# EAGLE design v2_routed (EAGLE 5.04)
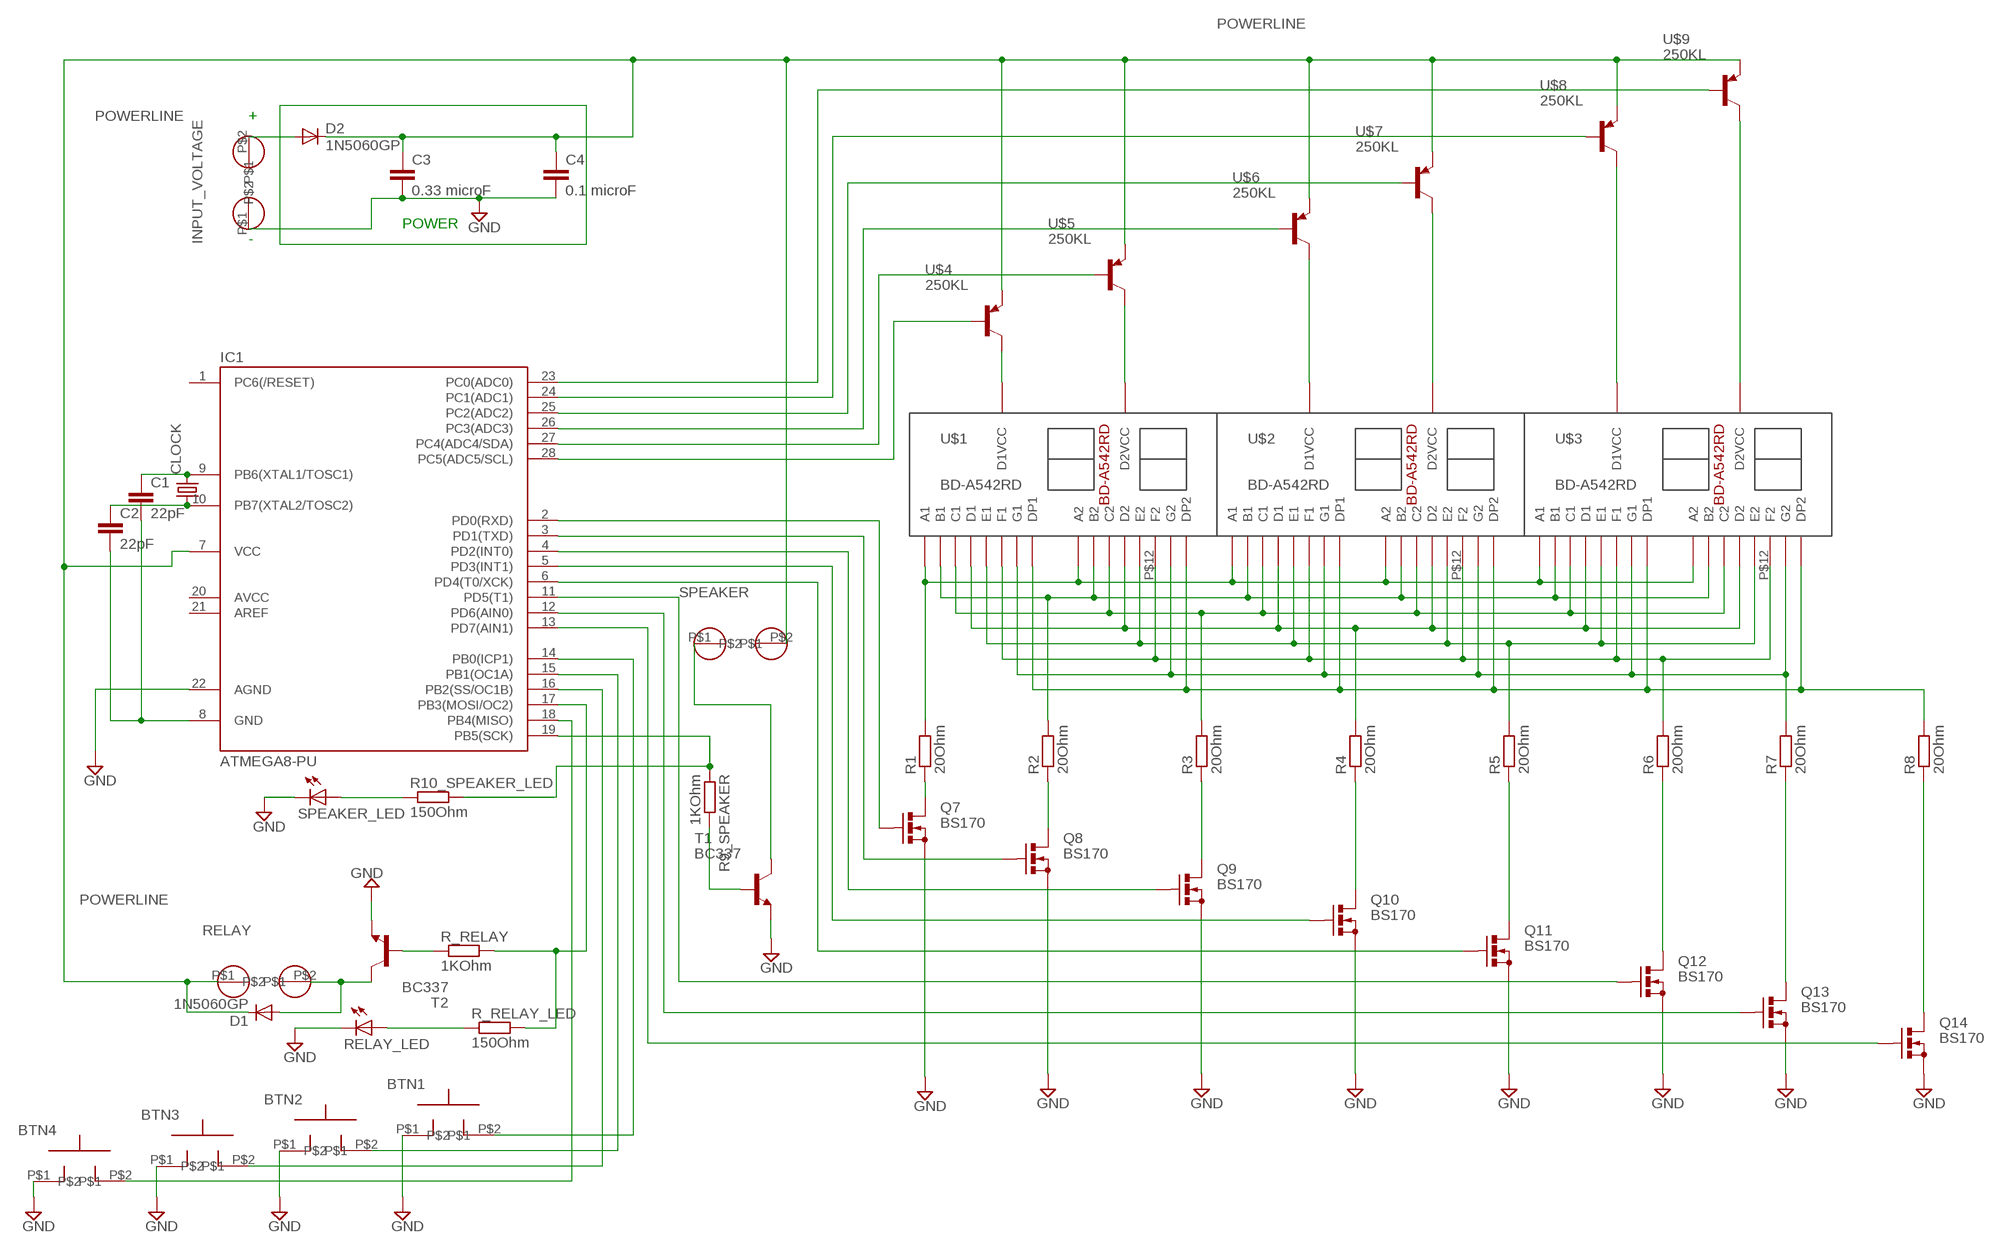
[diagram p0: schematic, sheet 1]

## Parts
BTN1  BUTTON_WIRES  [BUTTON_WIRES]
BTN2  BUTTON_WIRES  [BUTTON_WIRES]
BTN3  BUTTON_WIRES  [BUTTON_WIRES]
BTN4  BUTTON_WIRES  [BUTTON_WIRES]
C1  22pF  C2,5-3  [C2.5-3]
C2  22pF  C2,5-3  [C2.5-3]
C3  0.33 microF  C5/7.2  [C5B7.2]
C4  0.1 microF  C2.5/6  [C2.5-6]
CLOCK  CRYSTALTC26H  [TC26H]
D1  1N5060GP  [DO15-12]
D2  1N5060GP  [DO15-12]
IC1  ATMEGA8-PU  [DIL28-3]
INPUT_VOLTAGE  BUTTON_WIRES  [BUTTON_WIRES]
Q7  BS170  [SOT54E]
Q8  BS170  [SOT54E]
Q9  BS170  [SOT54E]
Q10  BS170  [SOT54E]
Q11  BS170  [SOT54E]
Q12  BS170  [SOT54E]
Q13  BS170  [SOT54E]
Q14  BS170  [SOT54E]
R1  20Ohm  R-EU_0207/15  [0207/15]
R2  20Ohm  R-EU_0207/15  [0207/15]
R3  20Ohm  R-EU_0207/15  [0207/15]
R4  20Ohm  R-EU_0207/15  [0207/15]
R5  20Ohm  R-EU_0207/15  [0207/15]
R6  20Ohm  R-EU_0207/15  [0207/15]
R7  20Ohm  R-EU_0207/15  [0207/15]
R8  20Ohm  R-EU_0207/15  [0207/15]
R9_SPEAKER  1KOhm  R-EU_0207/15  [0207/15]
R10_SPEAKER_LED  150Ohm  R-EU_0207/15  [0207/15]
R_RELAY  1KOhm  R-EU_0207/15  [0207/15]
R_RELAY_LED  150Ohm  R-EU_0207/15  [0207/15]
RELAY  BUTTON_WIRES  [BUTTON_WIRES]
RELAY_LED  LED5MM  [LED5MM]
SPEAKER  BUTTON_WIRES  [BUTTON_WIRES]
SPEAKER_LED  LED5MM  [LED5MM]
T1  BC337  [TO92]
T2  BC337  [TO92]
U$1  BD-A542RD  [BD-A542RD]
U$2  BD-A542RD  [BD-A542RD]
U$3  BD-A542RD  [BD-A542RD]
U$4  250KL  F0806AA  [TO92-EBC]
U$5  250KL  F0806AA  [TO92-EBC]
U$6  250KL  F0806AA  [TO92-EBC]
U$7  250KL  F0806AA  [TO92-EBC]
U$8  250KL  F0806AA  [TO92-EBC]
U$9  250KL  F0806AA  [TO92-EBC]

## Nets
GND: BTN1.P$1 BTN2.P$1 BTN3.P$1 BTN4.P$1 C3.2 C4.2 IC1.22(AGND) INPUT_VOLTAGE.P$1 Q7.S Q8.S Q9.S Q10.S Q11.S Q12.S Q13.S Q14.S RELAY_LED.K(C) SPEAKER_LED.K(C) T1.1(E) T2.1(E)
N$1: R1.2 U$1.P$11(A2) U$1.P$16(A1) U$2.P$11(A2) U$2.P$16(A1) U$3.P$11(A2) U$3.P$16(A1)
N$2: R2.2 U$1.P$10(B2) U$1.P$15(B1) U$2.P$10(B2) U$2.P$15(B1) U$3.P$10(B2) U$3.P$15(B1)
N$3: R3.2 U$1.P$3(C1) U$1.P$8(C2) U$2.P$3(C1) U$2.P$8(C2) U$3.P$3(C1) U$3.P$8(C2)
N$4: R4.2 U$1.P$2(D1) U$1.P$6(D2) U$2.P$2(D1) U$2.P$6(D2) U$3.P$2(D1) U$3.P$6(D2)
N$5: R5.2 U$1.P$1(E1) U$1.P$5(E2) U$2.P$1(E1) U$2.P$5(E2) U$3.P$1(E1) U$3.P$5(E2)
N$6: R6.2 U$1.P$12(F2) U$1.P$18(F1) U$2.P$12(F2) U$2.P$18(F1) U$3.P$12(F2) U$3.P$18(F1)
N$7: R7.2 U$1.P$7(G2) U$1.P$17(G1) U$2.P$7(G2) U$2.P$17(G1) U$3.P$7(G2) U$3.P$17(G1)
N$8: R8.2 U$1.P$4(DP1) U$1.P$9(DP2) U$2.P$4(DP1) U$2.P$9(DP2) U$3.P$4(DP1) U$3.P$9(DP2)
N$9: U$1.P$14(D1VCC) U$4.C
N$10: U$1.P$13(D2VCC) U$5.C
N$11: U$2.P$14(D1VCC) U$6.C
N$12: U$2.P$13(D2VCC) U$7.C
N$13: U$3.P$14(D1VCC) U$8.C
N$14: U$3.P$13(D2VCC) U$9.C
N$15: Q7.D R1.1
N$16: Q8.D R2.1
N$17: Q9.D R3.1
N$18: Q10.D R4.1
N$19: Q11.D R5.1
N$20: Q12.D R6.1
N$21: Q13.D R7.1
N$22: Q14.D R8.1
N$23: IC1.28(PC5(ADC5/SCL)) U$4.B
N$24: IC1.27(PC4(ADC4/SDA)) U$5.B
N$25: IC1.26(PC3(ADC3)) U$6.B
N$26: IC1.25(PC2(ADC2)) U$7.B
N$27: IC1.24(PC1(ADC1)) U$8.B
N$28: IC1.23(PC0(ADC0)) U$9.B
N$29: IC1.2(PD0(RXD)) Q7.G
N$30: IC1.3(PD1(TXD)) Q8.G
N$31: IC1.4(PD2(INT0)) Q9.G
N$32: IC1.5(PD3(INT1)) Q10.G
N$33: IC1.6(PD4(T0/XCK)) Q11.G
N$34: IC1.11(PD5(T1)) Q12.G
N$35: IC1.12(PD6(AIN0)) Q13.G
N$36: IC1.13(PD7(AIN1)) Q14.G
N$37: BTN1.P$2 IC1.14(PB0(ICP1))
N$38: BTN2.P$2 IC1.15(PB1(OC1A))
N$39: BTN3.P$2 IC1.16(PB2(SS/OC1B))
N$40: BTN4.P$2 IC1.18(PB4(MISO))
N$41: C1.1 CLOCK.2 IC1.9(PB6(XTAL1/TOSC1))
N$42: C2.1 CLOCK.1 IC1.10(PB7(XTAL2/TOSC2))
N$43: C1.2 C2.2 IC1.8(GND)
N$44: IC1.19(PB5(SCK)) R9_SPEAKER.1 R10_SPEAKER_LED.2
N$45: R9_SPEAKER.2 T1.2(B)
N$46: SPEAKER.P$1 T1.3(C)
N$47: D2.A INPUT_VOLTAGE.P$2
N$49: R10_SPEAKER_LED.1 SPEAKER_LED.A
N$50: IC1.17(PB3(MOSI/OC2)) R_RELAY.2 R_RELAY_LED.2
N$51: R_RELAY.1 T2.2(B)
N$52: D1.A RELAY.P$2 T2.3(C)
N$54: R_RELAY_LED.1 RELAY_LED.A
POWERLINE: C3.1 C4.1 D1.C D2.C IC1.7(VCC) RELAY.P$1 SPEAKER.P$2 U$4.E U$5.E U$6.E U$7.E U$8.E U$9.E
Unconnected: IC1.1(PC6(/RESET)) IC1.20(AVCC) IC1.21(AREF)

## Notes on the sheet
- +
- POWER
- -

## Library data of the parts
BTN1-BTN4 = button_wires:BUTTON_WIRES
C1-C4 = capacitor-wima:C: CAPACITOR naming: grid - package width
CLOCK = crystal:CRYSTAL: CRYSTAL
D1 D2 = diode:1N5060GP: DIODE controlled avalanche rectifier
IC1 = atmega8:ATMEGA8-PU
INPUT_VOLTAGE RELAY SPEAKER = output_wires:BUTTON_WIRES
Q7-Q14 = transistor-small-signal:BS170: N-CHANNEL MOS FET
R1-R8 R9_SPEAKER R10_SPEAKER_LED R_RELAY R_RELAY_LED = resistor:R-EU_: RESISTOR, European symbol
RELAY_LED SPEAKER_LED = led:LED: LED OSRAM: - CHIPLED LG R971, LG N971, LY N971, LG Q971, LY Q971, LO R971, LY R971 LH N974, LH R974 LS Q976, LO Q976, LY Q976 LO Q996 - Hyper CHIPLED LW Q18S LB Q993, LB Q99A, LB R99A - SideLED LS A670, LO A670, LY A670, LG A670, LP A670 LB A673, LV A673, LT A673, LW A673 LH A674 LY A675 LS A676, LA A676, LO A676, LY A676, LW A676 LS A679, LY A679, LG A679 - Hyper Micro SIDELED® LS Y876, LA Y876, LO Y876, LY Y876 LT Y87S - SmartLED LW L88C, LW L88S LB L89C, LB L89S, LG L890 LS L89K, LO L89K, LY L89K LS L896, LA L896, LO L896, LY L896 - TOPLED LS T670, LO T670, LY T670, LG T670, LP T670 LSG T670, LSP T670, LSY T670, LOP T670, LYG T670 LG T671, LOG T671, LSG T671 LB T673, LV T673, LT T673, LW T673 LH T674 LS T676, LA T676, LO T676, LY T676, LB T676, LH T676, LSB T676, LW T676 LB T67C, LV T67C, LT T67C, LS T67K, LO T67K, LY T67K, LW E67C LS E67B, LA E67B, LO E67B, LY E67B, LB E67C, LV E67C, LT E67C LW T67C LS T679, LY T679, LG T679 LS T770, LO T770, LY T770, LG T770, LP T770 LB T773, LV T773, LT T773, LW T773 LH T774 LS E675, LA E675, LY E675, LS T675 LS T776, LA T776, LO T776, LY T776, LB T776 LHGB T686 LT T68C, LB T68C - Hyper Mini TOPLED® LB M676 - Mini TOPLED Santana® LG M470 LS M47K, LO M47K, LY M47K Source: http://www.osram.convergy.de LUXEON: - LUMILED® LXK2-PW12-R00, LXK2-PW12-S00, LXK2-PW14-U00, LXK2-PW14-V00 LXK2-PM12-R00, LXK2-PM12-S00, LXK2-PM14-U00 LXK2-PE12-Q00, LXK2-PE12-R00, LXK2-PE12-S00, LXK2-PE14-T00, LXK2-PE14-U00 LXK2-PB12-K00, LXK2-PB12-L00, LXK2-PB12-M00, LXK2-PB14-N00, LXK2-PB14-P00, LXK2-PB14-Q00 LXK2-PR12-L00, LXK2-PR12-M00, LXK2-PR14-Q00, LXK2-PR14-R00 LXK2-PD12-Q00, LXK2-PD12-R00, LXK2-PD12-S00 LXK2-PH12-R00, LXK2-PH12-S00 LXK2-PL12-P00, LXK2-PL12-Q00, LXK2-PL12-R00 Source: www.luxeon.com KINGBRIGHT: KA-3528ASYC Source: www.kingbright.com
T1 T2 = transistor:BC337: NPN TRANSISTOR
U$1-U$3 = bd-a542rd:BD-A542RD
U$4-U$9 = transistor-pnp:F0806AA

## Board
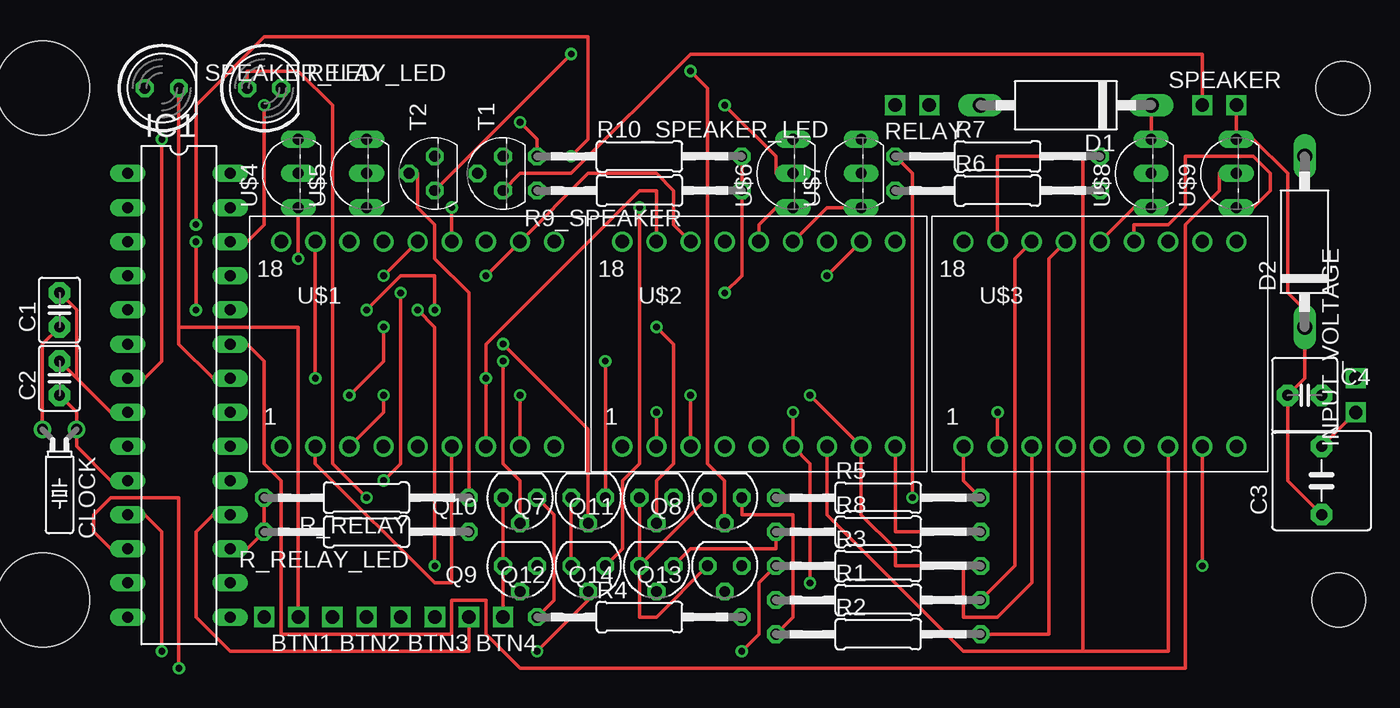
[diagram p1: board, top side]
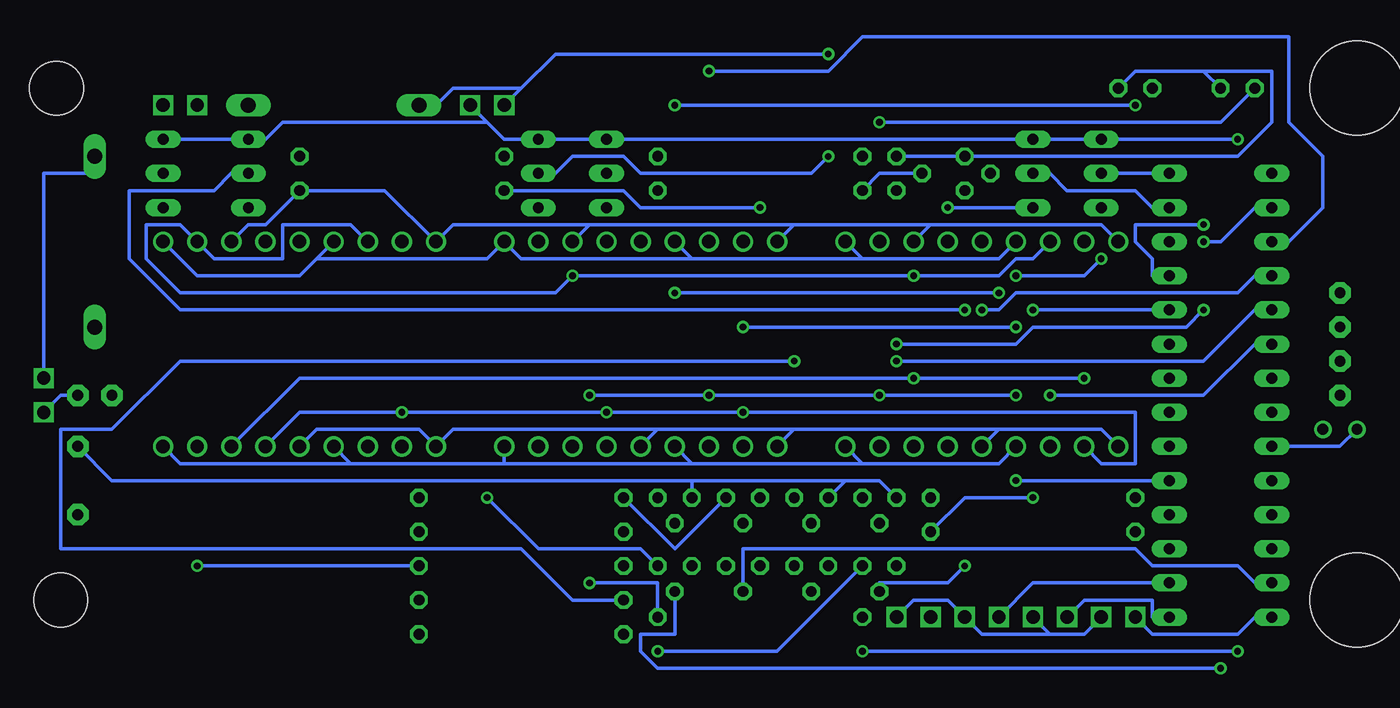
[diagram p2: board, bottom side, seen from below]

No outline drawn. Coordinates in mm, seen from the top.
Copper layers (1*16): Top 0.035mm / dielectric 1.5mm / Bottom 0.035mm
Design rules "agu_default": minimum track width 0.25mm, minimum drill 0.5mm, track to track 0.25mm, track to pad 0.25mm, pad to pad 0.25mm, via to via 0.25mm, smd to smd 0mil, copper to edge 40mil, drill to drill 8mil, minimum pad ring 10mil, minimum via ring 8mil, stop-mask expansion 4mil, vias tented up to drill 0mil, thermal gap 10mil
Holes 7 mm at 5.08,5.08 5.08,43.18
Holes 4 mm at 101.92,43.18 101.6,5.08

### Footprints (pad centres in the part's own frame; a part is rotated, then mirrored left to right if it is on the bottom)
BUTTON_WIRES = drill 1 square: P$1 -1.27,0; P$2 1.27,0
C2.5-3 = drill 0.813 pad 1.6 octagon: 1 -1.27,0; 2 1.27,0
C5B7.2 = drill 0.813 pad 1.6 octagon: 1 -2.54,0; 2 2.54,0
C2.5-6 = drill 0.813 pad 1.6 octagon: 1 -1.27,0; 2 1.27,0
TC26H = drill 0.813 round: 1 -1.27,0; 2 1.27,0
DO15-12 = drill 1.118 long: A 6.35,0; C -6.35,0
DIL28-3 = drill 0.813 long: 1 -16.51,-3.81; 2 -13.97,-3.81; 3 -11.43,-3.81; 4 -8.89,-3.81; 5 -6.35,-3.81; 6 -3.81,-3.81; 7 -1.27,-3.81; 8 1.27,-3.81; 9 3.81,-3.81; 10 6.35,-3.81; 11 8.89,-3.81; 12 11.43,-3.81; 13 13.97,-3.81; 14 16.51,-3.81; 15 16.51,3.81; 16 13.97,3.81; 17 11.43,3.81; 18 8.89,3.81; 19 6.35,3.81; 20 3.81,3.81; 21 1.27,3.81; 22 -1.27,3.81; 23 -3.81,3.81; 24 -6.35,3.81; 25 -8.89,3.81; 26 -11.43,3.81; 27 -13.97,3.81; 28 -16.51,3.81
SOT54E = drill 0.813 octagon: D -1.27,0; G 0,1.905; S 1.27,0
0207/15 = drill 0.813 octagon: 1 -7.62,0; 2 7.62,0
LED5MM = drill 0.813 octagon: A -1.27,0; K 1.27,0
TO92 = drill 0.813 octagon: 1 1.27,0; 2 0,1.905; 3 -1.27,0
BD-A542RD = drill 1 round: P$1 -10.16,-7.62; P$2 -7.62,-7.62; P$3 -5.08,-7.62; P$4 -2.54,-7.62; P$5 0,-7.62; P$6 2.54,-7.62; P$7 5.08,-7.62; P$8 7.62,-7.62; P$9 10.16,-7.62; P$10 10.16,7.62; P$11 7.62,7.62; P$12 5.08,7.62; P$13 2.54,7.62; P$14 0,7.62; P$15 -2.54,7.62; P$16 -5.08,7.62; P$17 -7.62,7.62; P$18 -10.16,7.62
TO92-EBC = drill 0.813 long: B 0,-1.27; C -2.54,-1.27; E 2.54,-1.27

### Placement (x,y rotation side)
BTN1  22.86,3.81 180 top
BTN2  27.94,3.81 180 top
BTN3  33.02,3.81 180 top
BTN4  38.1,3.81 180 top
C1  6.35,26.67 90 top
C2  6.35,21.59 90 top
C3  100.33,13.97 90 top
C4  99.06,20.32 0 top
CLOCK  6.35,17.78 180 top
D1  81.28,41.91 180 top
D2  99.06,31.75 90 top
IC1  15.24,20.32 270 top
INPUT_VOLTAGE  102.87,20.32 90 top
Q7  45.72,12.7 180 top
Q8  55.88,12.7 180 top
Q9  40.64,7.62 180 top
Q10  40.64,12.7 180 top
Q11  50.8,12.7 180 top
Q12  45.72,7.62 180 top
Q13  55.88,7.62 180 top
Q14  50.8,7.62 180 top
R1  67.31,5.08 0 top
R2  67.31,2.54 0 top
R3  67.31,7.62 0 top
R4  49.53,3.81 0 top
R5  67.31,12.7 0 top
R6  76.2,35.56 0 top
R7  76.2,38.1 0 top
R8  67.31,10.16 0 top
R9_SPEAKER  49.53,35.56 180 top
R10_SPEAKER_LED  49.53,38.1 0 top
R_RELAY  29.21,12.7 180 top
R_RELAY_LED  29.21,10.16 180 top
RELAY  69.85,41.91 180 top
RELAY_LED  21.59,43.18 0 top
SPEAKER  92.71,41.91 0 top
SPEAKER_LED  13.97,43.18 0 top
T1  39.37,36.83 90 top
T2  34.29,36.83 90 top
U$1  33.02,24.13 0 top
U$2  58.42,24.13 0 top
U$3  83.82,24.13 0 top
U$4  22.86,36.83 90 top
U$5  27.94,36.83 90 top
U$6  59.69,36.83 90 top
U$7  64.77,36.83 90 top
U$8  86.36,36.83 90 top
U$9  92.71,36.83 90 top

### Tracks (layer width: path | path; a pad name or v marks a point on that pad's centre or on a via)
GND
  Top 0.25: 15.24,25.4 SPEAKER_LED.K | 15.24,25.4 15.24,24.13 17.78,21.59 IC1.22 | Q14.S Q11.S | Q13.S 50.8,3.81 49.53,3.81 Q14.S | Q8.S Q14.S | C3.2 INPUT_VOLTAGE.P$1 | Q7.S Q12.S | BTN4.P$1 Q9.S Q10.S | 15.24,25.4 24.13,25.4 BTN1.P$1
  Bottom 0.25: T1.1 T2.1 13.97,38.1 11.43,40.64 11.43,44.45 16.51,44.45 | SPEAKER_LED.K 16.51,44.45 | 16.51,44.45 21.59,44.45 RELAY_LED.K | BTN1.P$1 25.4,2.54 27.94,2.54 | 27.94,2.54 BTN2.P$1 | 27.94,2.54 33.02,2.54 BTN3.P$1 35.56,5.08 38.1,5.08 BTN4.P$1 | INPUT_VOLTAGE.P$1 101.6,20.32 C4.2 | 43.18,13.97 Q7.S | 43.18,13.97 40.64,13.97 Q10.S | C3.2 97.79,13.97 54.61,13.97 | 43.18,13.97 54.61,13.97 | 54.61,13.97 Q8.S
N$1  (via drill 0.5)
  Top 0.25: v38.1,29.21 U$1.P$11 45.72,36.83 50.8,36.83 52.07,35.56 52.07,33.02 U$2.P$16 | v63.5,29.21 U$2.P$11 | R1.2 77.47,7.62 77.47,30.48 U$3.P$16
  Bottom 0.25: U$1.P$16 29.21,30.48 30.48,30.48 31.75,29.21 v38.1,29.21 v63.5,29.21 64.77,27.94 92.71,27.94 95.25,30.48 95.25,33.02 92.71,33.02 U$3.P$11 90.17,30.48 85.09,30.48 85.09,33.02 80.01,33.02 U$3.P$16
N$2
  Top 0.25: R2.2 80.01,2.54 80.01,30.48 U$3.P$15
  Bottom 0.25: U$1.P$15 31.75,30.48 41.91,30.48 | 41.91,30.48 U$1.P$10 | 54.61,30.48 U$2.P$15 | 41.91,30.48 54.61,30.48 | 54.61,30.48 67.31,30.48 U$2.P$10 69.85,30.48 82.55,30.48 | U$3.P$10 91.44,29.21 83.82,29.21 82.55,30.48 | 82.55,30.48 U$3.P$15
N$3  (via drill 0.5)
  Top 0.25: U$1.P$3 30.48,19.05 v30.48,20.32 | v40.64,20.32 U$1.P$8 | v53.34,20.32 U$2.P$3 | 73.66,7.62 68.58,7.62 68.58,8.89 66.04,11.43 U$2.P$8 v62.23,20.32 | 73.66,7.62 R3.2 | U$3.P$3 78.74,6.35 76.2,3.81 73.66,3.81 73.66,7.62 | v91.44,7.62 U$3.P$8
  Bottom 0.25: v30.48,20.32 v40.64,20.32 v53.34,20.32 v62.23,20.32 | R3.2 v91.44,7.62
N$4  (via drill 0.5)
  Top 0.25: U$1.P$2 25.4,15.24 34.29,6.35 35.56,6.35 U$1.P$6 | v62.23,6.35 62.23,15.24 U$2.P$6 v60.96,19.05 | v50.8,19.05 U$2.P$2 | v76.2,19.05 U$3.P$2
  Bottom 0.25: R4.2 57.15,6.35 v62.23,6.35 | U$3.P$6 83.82,19.05 v76.2,19.05 v60.96,19.05 v50.8,19.05 21.59,19.05 21.59,15.24 24.13,15.24 U$1.P$2
N$5
  Top 0.25: R5.2 73.66,13.97 U$3.P$1
  Bottom 0.25: U$3.P$5 82.55,17.78 74.93,17.78 U$3.P$1 72.39,17.78 57.15,17.78 | U$1.P$1 24.13,17.78 31.75,17.78 | 31.75,17.78 U$1.P$5 | 46.99,17.78 U$2.P$1 | 31.75,17.78 46.99,17.78 | 57.15,17.78 U$2.P$5 | 46.99,17.78 57.15,17.78
N$6
  Bottom 0.25: U$3.P$12 87.63,33.02 86.36,33.02 R6.2 77.47,35.56 U$3.P$18 72.39,33.02 62.23,33.02 | U$1.P$18 24.13,33.02 36.83,33.02 | 36.83,33.02 U$1.P$12 | 46.99,33.02 U$2.P$18 | 36.83,33.02 46.99,33.02 | 62.23,33.02 U$2.P$12 | 46.99,33.02 62.23,33.02
N$7  (via drill 0.5)
  Top 0.25: U$1.P$7 v38.1,21.59 38.1,24.13 49.53,35.56 50.8,35.56 U$2.P$17 | 82.55,38.1 76.2,38.1 U$3.P$17 | 82.55,38.1 R7.2 | U$2.P$7 63.5,11.43 73.66,1.27 82.55,1.27 | 82.55,1.27 88.9,1.27 U$3.P$7 | v25.4,21.59 U$1.P$17 | 82.55,1.27 82.55,38.1
  Bottom 0.25: v25.4,21.59 v38.1,21.59 83.82,21.59 U$3.P$7
N$8
  Top 0.25: R8.2 68.58,10.16 U$2.P$9
  Bottom 0.25: U$1.P$4 31.75,15.24 41.91,15.24 | 41.91,15.24 U$1.P$9 | 54.61,15.24 U$2.P$4 | 41.91,15.24 54.61,15.24 | 80.01,15.24 U$3.P$4 | 54.61,15.24 68.58,15.24 | 68.58,15.24 80.01,15.24 | U$3.P$9 92.71,15.24 80.01,15.24 | 68.58,15.24 U$2.P$9
N$9  (via drill 0.5)
  Top 0.25: v24.13,30.48 U$4.C | v30.48,29.21 U$1.P$14
  Bottom 0.25: v24.13,30.48 25.4,29.21 v30.48,29.21
N$10  (via drill 0.5)
  Top 0.25: v35.56,34.29 U$1.P$13
  Bottom 0.25: v35.56,34.29 30.48,34.29 U$5.C
N$11
  Top 0.25: U$2.P$14 58.42,33.02 59.69,34.29 U$6.C
N$12
  Top 0.25: U$2.P$13 63.5,34.29 64.77,34.29 U$7.C
N$13
  Top 0.25: U$3.P$14 86.36,34.29 U$8.C
N$14
  Top 0.25: U$3.P$13 86.36,33.02 88.9,33.02 90.17,34.29 90.17,38.1 95.25,38.1 96.52,36.83 96.52,35.56 95.25,34.29 U$9.C
N$15  (via drill 0.5)
  Top 0.25: Q7.D v46.99,22.86
  Bottom 0.25: v46.99,22.86 92.71,22.86 97.79,17.78 101.6,17.78 101.6,8.89 67.31,8.89 63.5,5.08 R1.1
N$16
  Top 0.25: R2.1 60.96,3.81 60.96,11.43 57.15,11.43 Q8.D
N$17  (via drill 0.5)
  Top 0.25: v57.15,1.27 58.42,2.54 58.42,6.35 R3.1
  Bottom 0.25: Q9.D 48.26,1.27 v57.15,1.27
N$18
  Top 0.25: R4.1 43.18,5.08 43.18,11.43 Q10.D
N$19
  Bottom 0.25: Q11.D 55.88,8.89 R5.1
N$20  (via drill 0.5)
  Top 0.25: Q12.D 48.26,8.89 48.26,13.97 49.53,15.24 v49.53,34.29
  Bottom 0.25: v49.53,34.29 58.42,34.29 59.69,35.56 R6.1
N$21  (via drill 0.5)
  Top 0.25: v69.85,12.7 69.85,36.83 R7.1
  Bottom 0.25: Q13.D 58.42,8.89 66.04,8.89 v69.85,12.7
N$22
  Top 0.25: Q14.D 53.34,8.89 59.69,8.89 R8.1
N$23
  Bottom 0.25: IC1.28 20.32,36.83 22.86,36.83 U$4.B
N$24
  Bottom 0.25: IC1.27 20.32,34.29 21.59,35.56 26.67,35.56 27.94,36.83 U$5.B
N$25  (via drill 0.5)
  Top 0.25: v21.59,41.91 21.59,33.02 20.32,31.75 IC1.26 | v55.88,41.91 59.69,38.1 59.69,36.83 U$6.B
  Bottom 0.25: v21.59,41.91 v55.88,41.91
N$26  (via drill 0.5)
  Top 0.25: v16.51,33.02 16.51,41.91 21.59,46.99 45.72,46.99 45.72,39.37 v44.45,38.1
  Bottom 0.25: v16.51,33.02 21.59,33.02 21.59,31.75 20.32,30.48 20.32,29.21 IC1.25 | v44.45,38.1 45.72,36.83 58.42,36.83 59.69,38.1 63.5,38.1 64.77,36.83 U$7.B
N$27  (via drill 0.5)
  Top 0.25: v29.21,26.67 31.75,29.21 34.29,29.21 v34.29,26.67
  Bottom 0.25: v29.21,26.67 20.32,26.67 IC1.24 | v34.29,26.67 92.71,26.67 96.52,30.48 96.52,35.56 90.17,35.56 88.9,36.83 U$8.B
N$28
  Top 0.25: IC1.23 20.32,24.13 21.59,22.86 21.59,15.24 22.86,13.97 22.86,2.54 35.56,2.54 35.56,5.08 38.1,5.08 38.1,2.54 40.64,0 90.17,0 90.17,33.02 92.71,35.56 92.71,36.83 U$9.B
N$29  (via drill 0.5)
  Top 0.25: v16.51,26.67 v16.51,31.75 | v39.37,24.13 45.72,17.78 45.72,11.43 Q7.G
  Bottom 0.25: v16.51,31.75 15.24,31.75 12.7,34.29 IC1.2 | v16.51,26.67 17.78,25.4 29.21,25.4 30.48,24.13 v39.37,24.13
N$30  (via drill 0.5)
  Top 0.25: v53.34,44.45 54.61,43.18 54.61,15.24 55.88,13.97 55.88,11.43 Q8.G
  Bottom 0.25: v53.34,44.45 44.45,44.45 41.91,46.99 10.16,46.99 10.16,40.64 7.62,38.1 7.62,34.29 10.16,31.75 IC1.3
N$31  (via drill 0.5)
  Top 0.25: v33.02,26.67 34.29,25.4 v34.29,7.62
  Bottom 0.25: v33.02,26.67 31.75,26.67 30.48,27.94 13.97,27.94 12.7,29.21 IC1.4 | v34.29,7.62 35.56,6.35 40.64,6.35 Q9.G
N$32  (via drill 0.5)
  Top 0.25: v39.37,22.86 39.37,15.24 40.64,13.97 40.64,11.43 Q10.G
  Bottom 0.25: v39.37,22.86 16.51,22.86 12.7,26.67 IC1.5
N$33  (via drill 0.5)
  Top 0.25: v27.94,20.32 30.48,22.86 v30.48,25.4 | v50.8,25.4 52.07,24.13 52.07,15.24 50.8,13.97 50.8,11.43 Q11.G
  Bottom 0.25: v27.94,20.32 16.51,20.32 12.7,24.13 IC1.6 | v30.48,25.4 v50.8,25.4
N$34  (via drill 0.5)
  Top 0.25: v13.97,1.27 13.97,10.16 12.7,11.43 IC1.11 | v41.91,1.27 45.72,5.08 Q12.G
  Bottom 0.25: v13.97,1.27 v41.91,1.27
N$35  (via drill 0.5)
  Top 0.25: v15.24,0 15.24,12.7 10.16,12.7 8.89,11.43 8.89,10.16 10.16,8.89 IC1.12
  Bottom 0.25: v15.24,0 57.15,0 58.42,1.27 58.42,2.54 55.88,2.54 55.88,5.08 Q13.G
N$36
  Bottom 0.25: Q14.G 50.8,6.35 50.8,8.89 21.59,8.89 20.32,7.62 13.97,7.62 12.7,6.35 IC1.13
N$37
  Bottom 0.25: BTN1.P$2 20.32,2.54 13.97,2.54 12.7,3.81 IC1.14
N$38
  Bottom 0.25: BTN2.P$2 25.4,5.08 20.32,5.08 20.32,3.81 IC1.15
N$39
  Bottom 0.25: BTN3.P$2 29.21,6.35 20.32,6.35 IC1.16
N$40
  Top 0.25: BTN4.P$2 36.83,1.27 19.05,1.27 16.51,3.81 16.51,10.16 17.78,11.43 IC1.18
N$41
  Top 0.25: C1.1 5.08,24.13 CLOCK.2
  Bottom 0.25: CLOCK.2 6.35,16.51 10.16,16.51 IC1.9
N$42
  Top 0.25: IC1.10 10.16,13.97 7.62,16.51 CLOCK.1 7.62,19.05 C2.1
N$43
  Top 0.25: C2.2 7.62,21.59 | 7.62,21.59 10.16,19.05 IC1.8 | C1.2 7.62,26.67 7.62,21.59
N$44  (via drill 0.5)
  Top 0.25: v30.48,13.97 31.75,15.24 v31.75,27.94 | v55.88,27.94 57.15,29.21 R9_SPEAKER.1 R10_SPEAKER_LED.2
  Bottom 0.25: v30.48,13.97 20.32,13.97 IC1.19 | v31.75,27.94 v55.88,27.94
N$45
  Bottom 0.25: R9_SPEAKER.2 40.64,36.83 38.1,36.83 T1.2
N$46
  Top 0.25: T1.3 40.64,36.83 44.45,36.83 53.34,45.72 91.44,45.72 SPEAKER.P$1
N$47
  Bottom 0.25: INPUT_VOLTAGE.P$2 102.87,36.83 99.06,36.83 D2.A
N$49  (via drill 0.5)
  Top 0.25: v40.64,40.64 41.91,39.37 R10_SPEAKER_LED.1
  Bottom 0.25: SPEAKER_LED.A 15.24,40.64 v40.64,40.64
N$50
  Top 0.25: IC1.17 20.32,8.89 R_RELAY_LED.2 R_RELAY.2
N$51
  Top 0.25: R_RELAY.1 36.83,27.94 34.29,30.48 34.29,33.02 33.02,34.29 33.02,36.83 T2.2
N$52  (via drill 0.5)
  Top 0.25: T2.3 v44.45,45.72
  Bottom 0.25: v44.45,45.72 64.77,45.72 67.31,43.18 | 67.31,43.18 RELAY.P$2 | 67.31,43.18 72.39,43.18 73.66,41.91 D1.A
N$54  (via drill 0.5)
  Top 0.25: v29.21,12.7 26.67,15.24 26.67,41.91 24.13,44.45 20.32,44.45 RELAY_LED.A
  Bottom 0.25: R_RELAY_LED.1 34.29,12.7 v29.21,12.7
POWERLINE  (via drill 0.5)
  Top 0.25: v13.97,39.37 13.97,22.86 12.7,21.59 IC1.7 | C3.1 97.79,13.97 C4.1 99.06,21.59 99.06,24.13 D2.C 99.06,26.67 97.79,27.94 97.79,36.83 95.25,39.37 U$9.E SPEAKER.P$2 | U$8.E D1.C
  Bottom 0.25: v13.97,39.37 22.86,39.37 U$4.E 25.4,39.37 27.94,39.37 U$5.E 30.48,39.37 59.69,39.37 U$6.E 62.23,39.37 64.77,39.37 U$7.E 67.31,39.37 68.58,39.37 69.85,40.64 | U$9.E 92.71,39.37 88.9,39.37 U$8.E 86.36,39.37 85.09,40.64 69.85,40.64 | 69.85,40.64 RELAY.P$1